# Altium schematic sheet Telemetry-Power.SchDoc
size A
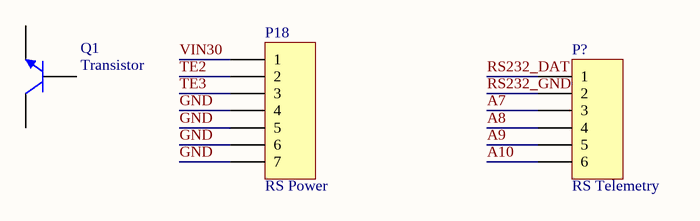
[diagram p0: Telemetry-Power.SchDoc]

## Parts
P18  RS Power  [HDR1X7]
P?  RS Telemetry  [HDR1X6]
Q1  Transistor  [TO-226-AA]

## Nets
A7: P?.3
A8: P?.4
A9: P?.5
A10: P?.6
GND: P18.4 P18.5 P18.6 P18.7
RS232_DAT: P?.1
RS232_GND: P?.2
TE2: P18.2
TE3: P18.3
VIN30: P18.1

Not connected (* = marked no-connect by the designer): Q1 1(C) 2(B) 3(E)

## Library data of the parts
P18 = Header 7: Header, 7-Pin; LatestRevisionDate: 17-Jul-2002; LatestRevisionNote: Re-released for DXP Platform.; Publisher: Altium Limited
P? = Header 6: Header, 6-Pin; LatestRevisionDate: 17-Jul-2002; LatestRevisionNote: Re-released for DXP Platform.; Publisher: Altium Limited
Q1 = NPN: NPN Bipolar Transistor; Published: 8-Jun-2000; LatestRevisionDate: 17-Jul-2002; LatestRevisionNote: Re-released for DXP Platform.; PackageReference: TO-226-AA; Publisher: Altium Limited; PackageDescription: TO, Flat Index; 3 In-Line, Axial Leads; Body Dia. 4.8mm; Leads 0.55 x 0.51 mm (max); Code_JEDEC: TO-226-AA